# Altium schematic sheet gps.SchDoc
size A
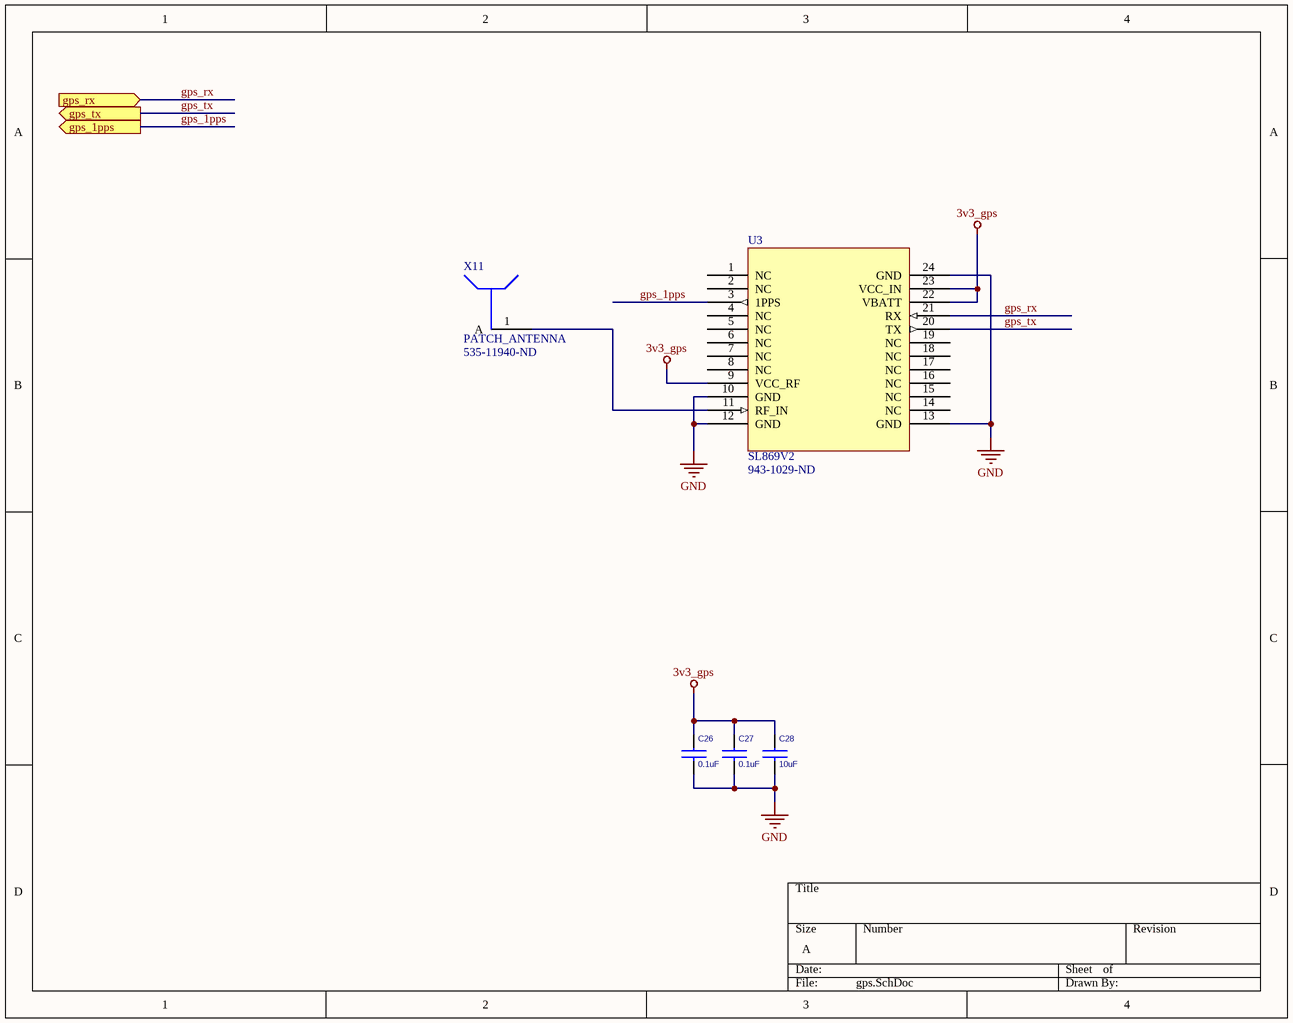
[diagram p0: gps.SchDoc]

## Parts
C26  0.1uF  [CAPC2012X09M]
C27  0.1uF  [CAPC2012X09M]
C28  10uF  [CAPC2012X09M]
U3  SL869V2  Supplier Part Number 1: 943-1029-ND  [SL869V2_FOOT]
X11  PATCH_ANTENNA  Supplier Part Number 1: 535-11940-ND  [PATCH_ANTENNA]

## Ports
gps_1pps (out), gps_rx (in), gps_tx (out)

## Nets
3v3_gps: C26.1 C27.1 C28.1 U3.9(VCC_RF) U3.22(VBATT) U3.23(VCC_IN)
GND: C26.2 C27.2 C28.2 U3.10(GND) U3.12(GND) U3.13(GND) U3.24(GND)
gps_1pps: U3.3(1PPS) ; port gps_1pps
gps_rx: U3.21(RX) ; port gps_rx
gps_tx: U3.20(TX) ; port gps_tx
NetU3_11: U3.11(RF_IN) X11.1(A)

Not connected (* = marked no-connect by the designer): U3 1(NC) 2(NC) 4(NC) 5(NC) 6(NC) 7(NC) 8(NC) 14(NC) 15(NC) 16(NC) 17(NC) 18(NC) 19(NC)

## Library data of the parts
C26 C27 = CAP_SMD_0.1UF_10%: CAP CER 0.1UF 25V 10% X7R 0805; Value: 0.1uF; Supplier 1: Digi-Key; Supplier Part Number 1: 399-1168-6-ND
C28 = CAP_SMD_10UF_20%: CAP CER 10UF 16V 20% X5R 0805; Value: 10uF; Supplier 1: Digi-Key; Supplier Part Number 1: 399-8013-1-ND
U3 = SL869V2: Supplier 1: Digi-Key
X11 = PATCH_ANTENNA: Supplier 1: Digi-Key